# EAGLE design Piezo (EAGLE 6.1)
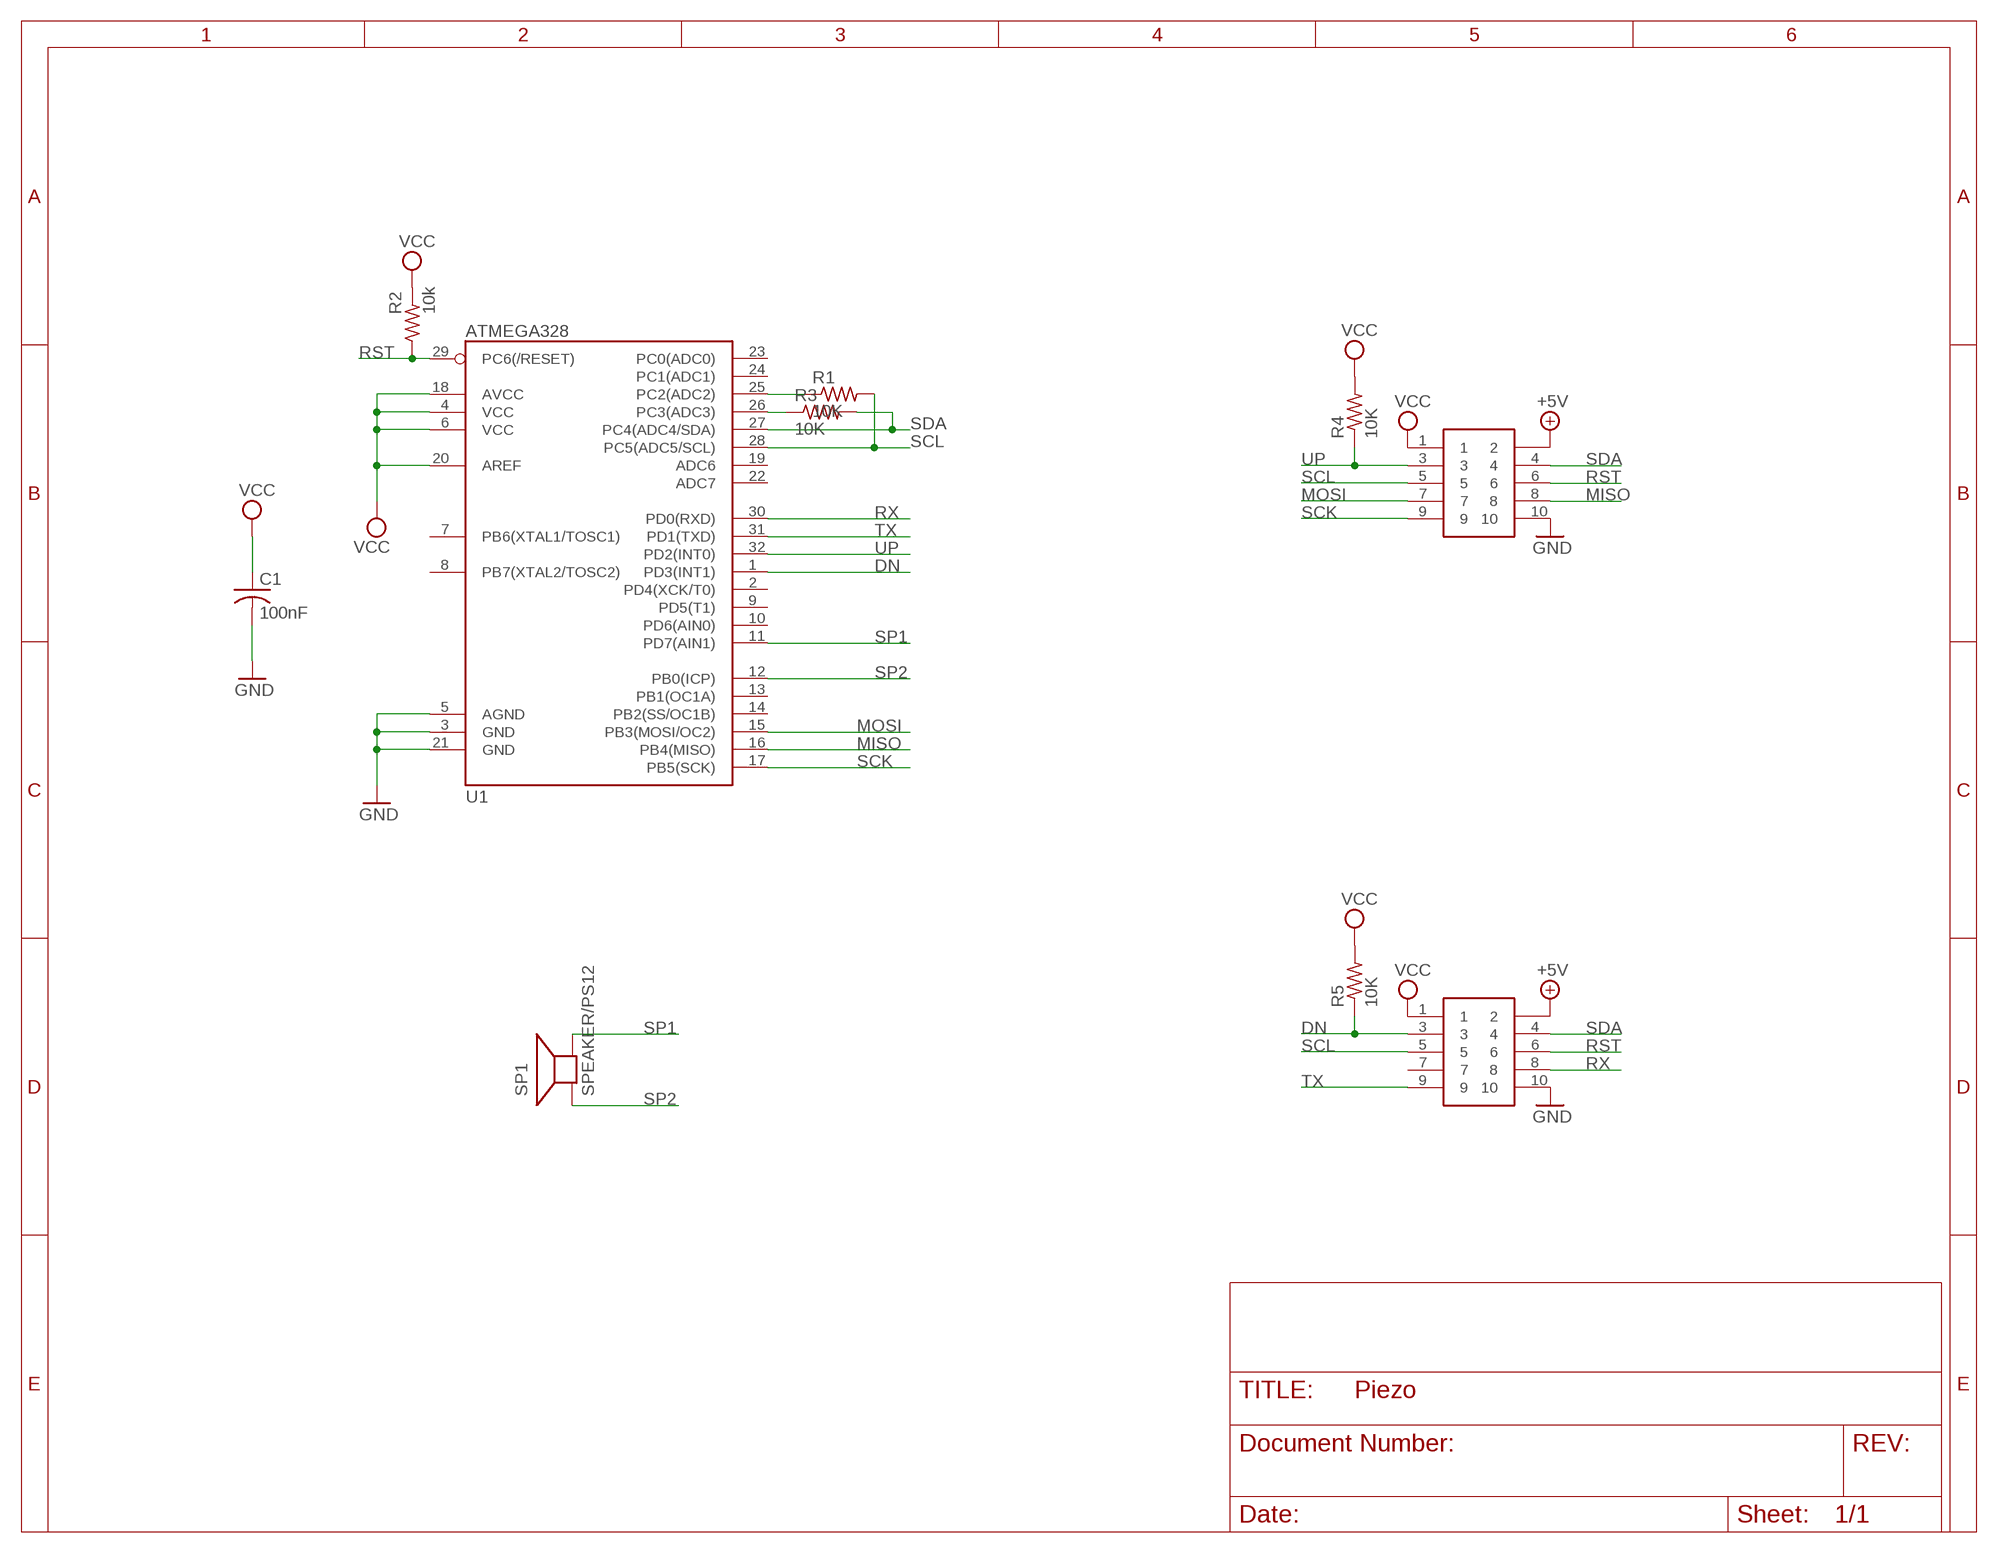
[diagram p0: schematic, sheet 1]

## Parts
*  SHF105SM  [SHF105DSM]
C1  100nF  C-USC0603K  [C0603K]
R1  10K  R-US_R0603  [R0603]
R2  10k  R-US_R0603  [R0603]
R3  10K  R-US_R0603  [R0603]
R4  10K  R-US_R0603  [R0603]
R5  10K  R-US_R0603  [R0603]
SP1  SPEAKER/PS12  [PS12]
U1  ATMEGA328  ATMEGA168  [TQFP32-08]
XY  SHF105SM  [SHF105DSM]

## Nets
+5V: *.2 XY.2
DN: *.3 R5.1 U1.1(PD3(INT1))
GND: *.10 C1.2 U1.3(GND) U1.5(AGND) U1.21(GND) XY.10
MISO: U1.16(PB4(MISO)) XY.8
MOSI: U1.15(PB3(MOSI/OC2)) XY.7
N$1: R1.1 U1.25(PC2(ADC2))
N$2: R3.1 U1.26(PC3(ADC3))
RST: *.6 R2.1 U1.29(PC6(/RESET)) XY.6
RX: *.8 U1.30(PD0(RXD))
SCK: U1.17(PB5(SCK)) XY.9
SCL: *.5 R1.2 U1.28(PC5(ADC5/SCL)) XY.5
SDA: *.4 R3.2 U1.27(PC4(ADC4/SDA)) XY.4
SP1: SP1.P$2(-) U1.11(PD7(AIN1))
SP2: SP1.P$1(+) U1.12(PB0(ICP))
TX: *.9 U1.31(PD1(TXD))
UP: R4.1 U1.32(PD2(INT0)) XY.3
VCC: *.1 C1.1 R2.2 R4.2 R5.2 U1.4(VCC) U1.6(VCC) U1.18(AVCC) U1.20(AREF) XY.1
Unconnected: *.7 U1.2(PD4(XCK/T0)) U1.7(PB6(XTAL1/TOSC1)) U1.8(PB7(XTAL2/TOSC2)) U1.9(PD5(T1)) U1.10(PD6(AIN0)) U1.13(PB1(OC1A)) U1.14(PB2(SS/OC1B)) U1.19(ADC6) U1.22(ADC7) U1.23(PC0(ADC0)) U1.24(PC1(ADC1))

## Library data of the parts
* XY = Gadgeteer:SHF105
C1 = rcl:C-US: CAPACITOR, American symbol
R1 R3-R5 = rcl:R-US_: RESISTOR, American symbol
R2 = resistor:R-US_: RESISTOR, American symbol
SP1 = adafruit:SPEAKER: SPEAKER Source: Buerklin Added PS12 (for part # PS1240 piezo) http://www.ladyada.net/library/pcb/eaglelibrary.html
U1 = SparkFun:ATMEGA168

## Net classes
0 default: width 0.254 mm

## Board
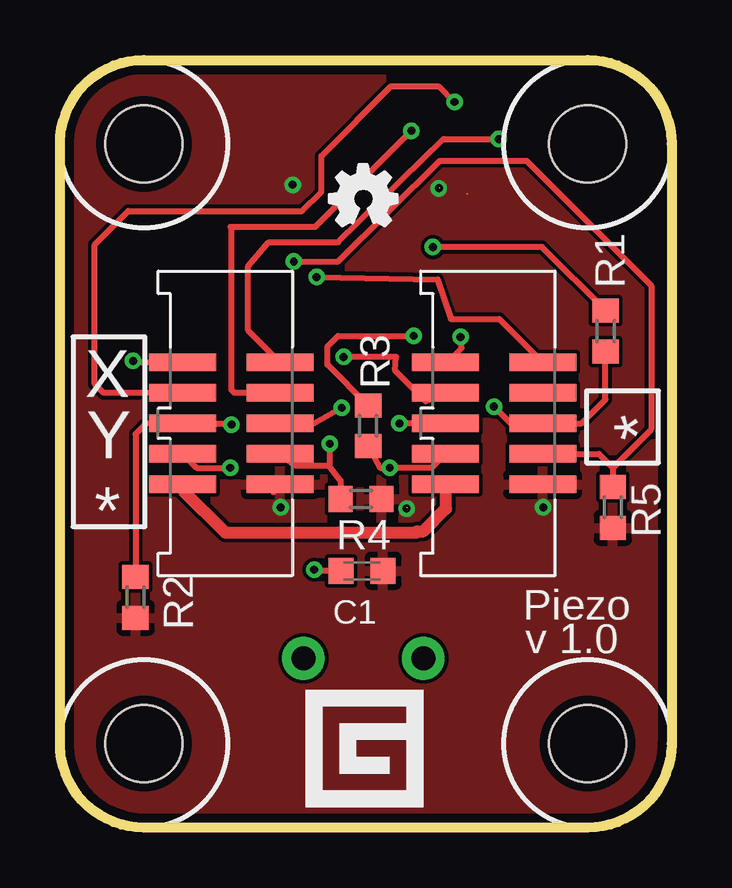
[diagram p1: board, top side]
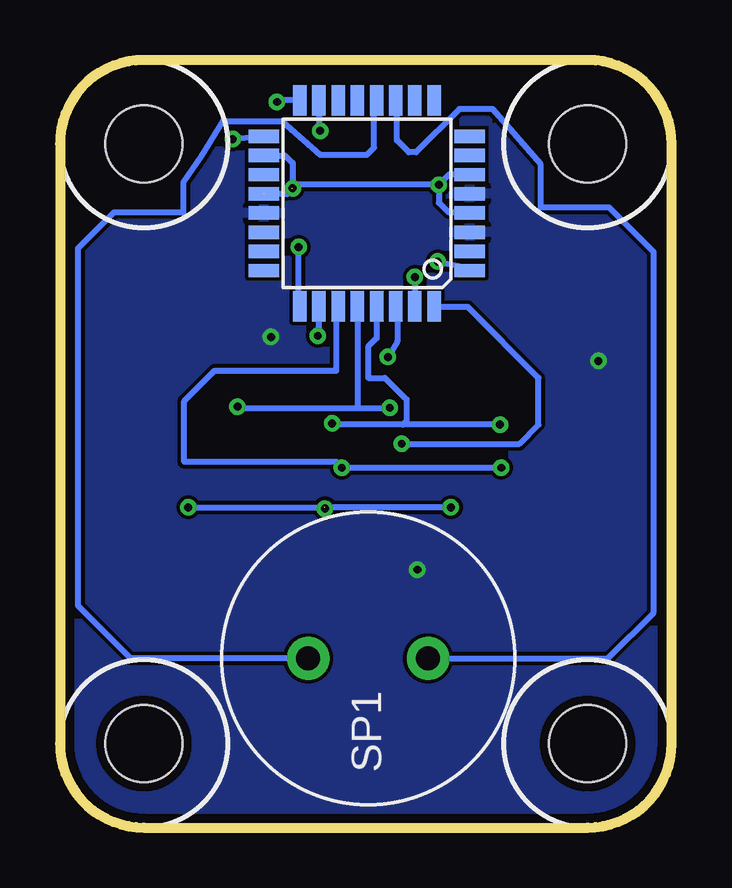
[diagram p2: board, bottom side, seen from below]

Size 25.5 x 32 mm. Coordinates in mm from the lower left corner, seen from the top.
Outline: 22,0 3.5,0 arc-90 0,3.5 0,28.5 arc-90 3.5,32 22,32 arc-90 25.5,28.5 25.5,3.5 arc-90 22,0
Copper layers (1*16): Top 0.0356mm / dielectric 1.5011mm / Bottom 0.0356mm
Design rules: minimum track width 6mil, minimum drill 13mil, track to track 6mil, track to pad 6mil, pad to pad 6mil, via to via 6mil, smd to smd 6mil, copper to edge 15mil, drill to drill 6mil, minimum pad ring 7mil, minimum via ring 7mil, stop-mask expansion 4mil, vias tented up to drill 0mil, thermal gap 10mil

### Footprints (pad centres in the part's own frame; a part is rotated, then mirrored left to right if it is on the bottom)
SHF105DSM = smd 2.794 x 0.737: 1 -2.032,2.54; 2 2.032,2.54; 3 -2.032,1.27; 4 2.032,1.27; 5 -2.032,0; 6 2.032,0; 7 -2.032,-1.27; 8 2.032,-1.27; 9 -2.032,-2.54; 10 2.032,-2.54
C0603K = smd 1.05 x 1.08: 1 -0.875,0; 2 0.875,0
R0603 = smd 1 x 1.1: 1 -0.85,0; 2 0.85,0
PS12 = drill 1 pad 1.778: P$1 -2.5,0; P$2 2.5,0
TQFP32-08 = smd 1.27 x 0.559: 1 -4.293,2.8; 2 -4.293,2; 3 -4.293,1.2; 4 -4.293,0.4; 5 -4.293,-0.4; 6 -4.293,-1.2; 7 -4.293,-2; 8 -4.293,-2.8; 17 4.293,-2.8; 18 4.293,-2; 19 4.293,-1.2; 20 4.293,-0.4; 21 4.293,0.4; 22 4.293,1.2; 23 4.293,2; 24 4.293,2.8 | smd 0.559 x 1.27: 9 -2.8,-4.293; 10 -2,-4.293; 11 -1.2,-4.293; 12 -0.4,-4.293; 13 0.4,-4.293; 14 1.2,-4.293; 15 2,-4.293; 16 2.8,-4.293; 25 2.8,4.293; 26 2,4.293; 27 1.2,4.293; 28 0.4,4.293; 29 -0.4,4.293; 30 -1.2,4.293; 31 -2,4.293; 32 -2.8,4.293
HOLE3.2 = hole 3.2: 0,0

### Placement (x,y rotation side)
*  18.1,16.85 180 top
C1  12.6,10.7 180 top
R1  22.75,20.7 270 top
R2  3.15,9.6 270 top
R3  12.85,16.75 270 top
R4  12.55,13.7 0 top
R5  23.05,13.35 270 top
SP1  12.65,7.05 0 bottom
U1  12.7,26.02 180 bottom
U$1  [HOLE3.2]  3.5,3.5 0 top
U$2  [HOLE3.2]  22,3.5 0 top
U$3  [HOLE3.2]  22,28.5 0 top
U$4  [HOLE3.2]  3.5,28.5 0 top
U$5  [LABEL_XYASTERISK]  0.05,12.45 0 top
U$6  [LABEL_ASTERISK]  24.95,15.2 90 top
U$7  [GADGETEER_LOGO_SMALL]  10.25,0.85 0 top
U$8  [OSHW_LOGO]  12.65,26.21 0 top
XY  7.15,16.85 180 top

### Tracks (layer width: path | path; a pad name or v marks a point on that pad's centre or on a via)
+5V
  Top 0.508: XY.2 5.12,14.08 6.9,12.3 14.85,12.3 14.9,12.35 15.15,12.35 16.1,13.3 16.1,14.28 *.2
DN  (via drill 0.33)
  Top 0.254: *.3 22.47,15.58 23.05,15 | 23.05,15 R5.1 | R5.1 | v9.75,23.6 11.6,23.6 15.85,27.8 19.45,27.8 24.65,22.6 24.65,16.6 23.05,15
  Bottom 0.254: v9.75,23.6 8.54,23.35 U1.1
GND  (via drill 0.33)
  Top 0.254: XY.10 3.11,19.39 v3.05,19.45 | 16.15,19.39 16.75,19.99 v16.7,20.45 | C1.2 10.65,10.7 v10.6,10.75
  Top 0.406: *.10 16.15,19.39
  pour Bottom: 0,32 0,0 25.5,0 25.5,32
MISO  (via drill 0.33)
  Top 0.254: XY.8 1.83,18.12 1.45,18.5 1.45,24.3 2.85,25.7 10.1,25.7 10.9,26.5 10.9,28 13.8,30.9 15.8,30.9 v16.45,30.25
  Bottom 0.254: U1.16 16.39,30.31 v16.45,30.25
MOSI  (via drill 0.33)
  Top 0.254: XY.7 7.28,18.12 7.15,18.25 7.15,25 7.1,25.05 10.65,25.05 v14.65,29.05
  Bottom 0.254: U1.15 14.7,29.1 v14.65,29.05
N$1  (via drill 0.33)
  Top 0.254: R1.1 20.1,24.2 v15.55,24.2
  Bottom 0.254: U1.25 15.55,21.78 v15.55,24.2
N$2  (via drill 0.33)
  Top 0.254: R3.1 11.15,19.3 11.15,20.05 11.6,20.5 v14.75,20.5
  Bottom 0.254: v14.75,20.5 14.7,20.55 U1.26
RST  (via drill 0.33)
  Top 0.254: R2.1 3.15,16.4 3.6,16.85 XY.6 7.1,16.85 v7.15,16.8 | R2.1 | *.6 14.45,16.85 v14.15,16.85
  Bottom 0.254: v7.15,16.8 11.2,16.8 | 11.2,16.8 14.1,16.8 v14.15,16.85 | U1.29 | U1.29 12.3,20.4 12.65,20.05 12.65,18.75 11.95,18.75 11.05,17.85 11.05,16.95 11.2,16.8
RX  (via drill 0.33)
  Top 0.254: v11.83,19.62 14.02,19.62 13.97,19.05 15.24,17.78 *.8
  Bottom 0.254: U1.30 11.43,21.59 11.43,20.27 v11.83,19.62
SCK  (via drill 0.33)
  Top 0.254: XY.9 7.85,20.72 7.85,23.4 8.7,24.4 11.6,24.4 16,28.7 v18.3,28.7
  Bottom 0.254: U1.17 17.01,28.8 v18.3,28.7
SCL  (via drill 0.33)
  Top 0.254: R1.2 22.75,17.85 21.75,16.85 *.5 18.8,16.85 v18.1,17.55 | R1.2 | v11.75,17.5 10.6,16.85 XY.5
  Bottom 0.254: v18.1,17.55 18.05,17.5 13.1,17.5 | 13.1,17.5 v11.75,17.5 | U1.28 | U1.28 13.1,17.5
SDA  (via drill 0.33)
  Top 0.254: *.4 15.49,15 v13.75,15 13.35,15 R3.2 | XY.4 5.7,15 v7.1,15
  Bottom 0.254: v7.1,15 v13.75,15 13.97,15.24 20.32,15.24 20.32,17.78 19.05,19.05 13.97,19.05 13.97,21.59 U1.27
SP1
  Bottom 0.254: SP1.P$2 2.65,7.05 0.75,8.95 0.75,24 2.6,25.85 5.45,25.85 5.45,27.65 7.45,29.95 8.85,29.95 10.65,28.15 10.95,28.15 11.45,28.65 11.45,30.26 U1.11
SP2
  Bottom 0.254: SP1.P$1 22.55,7.05 24.75,9.25 24.75,24.15 23.25,25.65 20.35,25.65 20.35,26.1 20.35,26.9 19.6,28 18.7,29.45 16.25,29.45 14.65,28.05 12.7,28.05 12.4,28.35 12.4,30.21 U1.12
TX  (via drill 0.33)
  Top 0.254: v10.7,22.95 15.75,22.85 16.3,21.2 18.32,21.2 *.9
  Bottom 0.254: v10.7,22.95 U1.31 | U1.31
UP  (via drill 0.33)
  Top 0.254: XY.3 9.81,15.1 11.2,15.1 | 11.2,15.1 11.7,14.45 R4.1 | v11.25,16 11.25,15.15 11.2,15.1
  Bottom 0.254: v11.25,16 6.35,16 5.55,16.8 5.55,18.75 8.5,21.7 9.87,21.7 U1.32
VCC  (via drill 0.33)  (3 unrouted)
  Top 0.254: 8.89,14.31 8.89,13.97 XY.1
  Bottom 0.254: U1.18 16.12,28.02 15.8,27.7 v15.8,26.65 16.05,26.4 17,26.4 | U1.6 9.28,27.22 v9.7,26.8 | v9.7,26.8 9.7,26.05 9.3,25.65 8.44,25.65 U1.4 | v9.2,13.35 14.45,13.35 14.55,13.25 | v20.15,13.35 14.5,13.35 v14.45,13.3 | v9.7,26.8 15.7,26.8 15.85,26.65
  pour Top: 0.6,32 0.6,0 25.5,0 25.5,32

### Text on the board
tNames: Piezo | v 1.0